# Altium schematic sheet DDR_HDMI.SchDoc
size A4; SheetNumber: 2; SheetTotal: 5
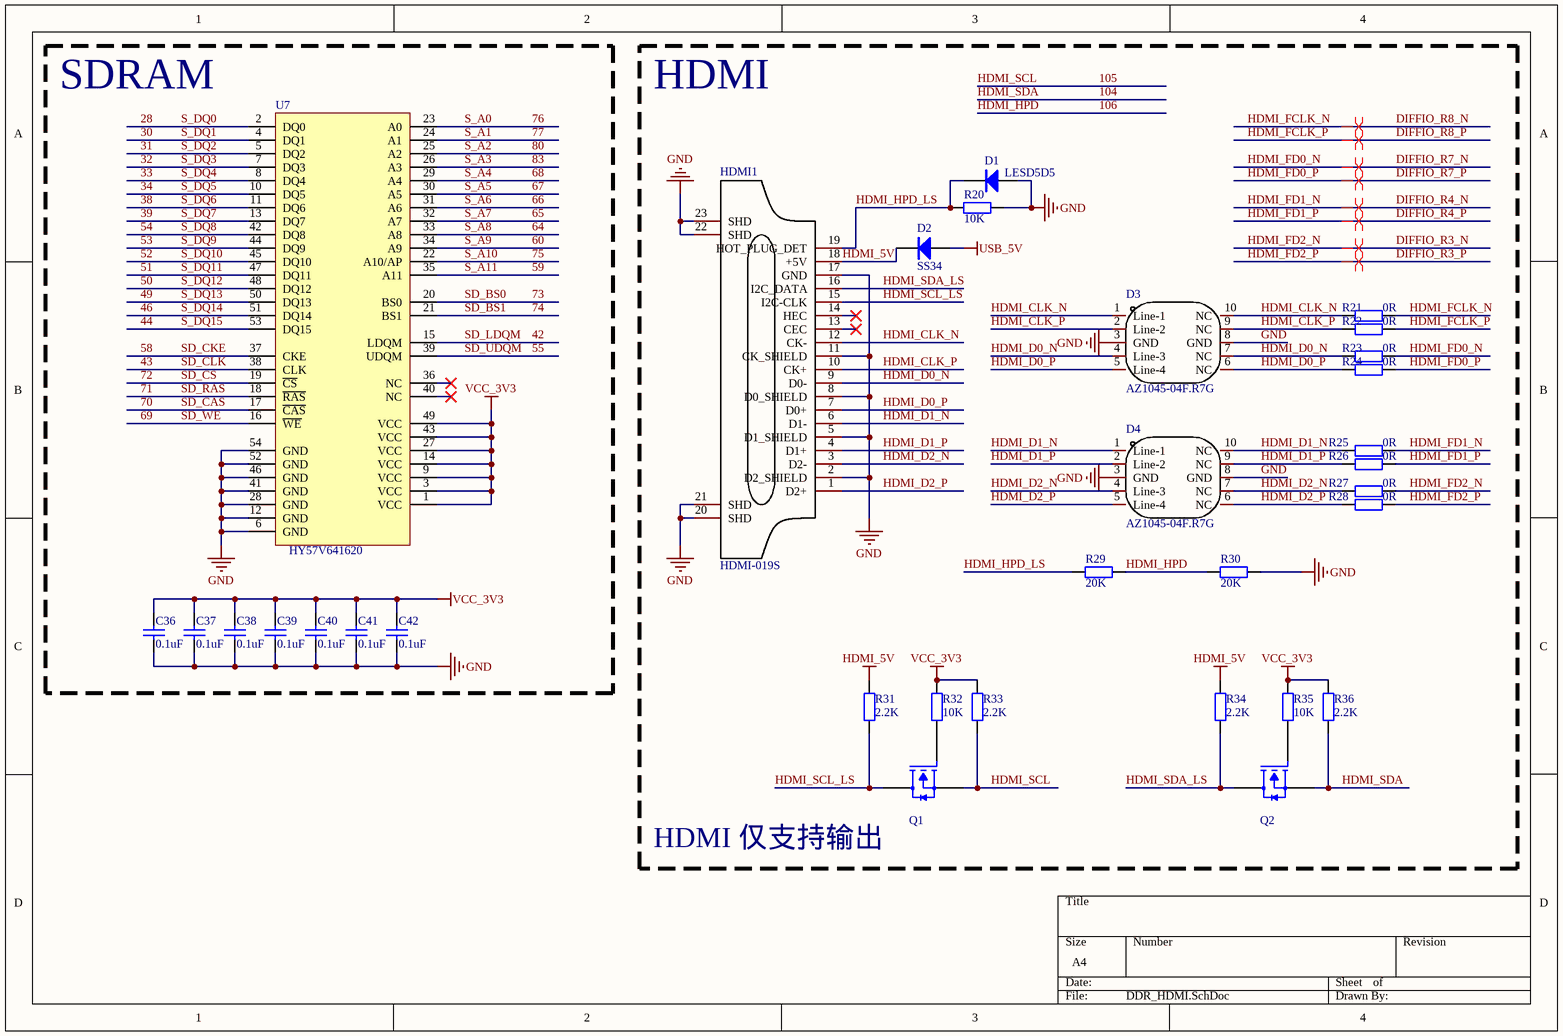
[diagram p0: DDR_HDMI.SchDoc]

## Parts
C36  0.1uF  [0402_C]
C37  0.1uF  [0402_C]
C38  0.1uF  [0402_C]
C39  0.1uF  [0402_C]
C40  0.1uF  [0402_C]
C41  0.1uF  [0402_C]
C42  0.1uF  [0402_C]
D1  LESD5D5  [SOD-523_L1.2-W0.8-LS1.6-RD]
D2  SS34  [SMC]
D3  AZ1045-04F.R7G  [DFN2510-10_L2.5-W1.0-P0.50-BL]
D4  AZ1045-04F.R7G  [DFN2510-10_L2.5-W1.0-P0.50-BL]
HDMI1  HDMI-019S  [HDMI-SMD_HDMI-019S]
Q1  AO3400A  [SOT23-3]  (value not drawn)
Q2  AO3400A  [SOT23-3]  (value not drawn)
R20  10K  [0402_R]
R21  0R  [0402_R]
R22  0R  [0402_R]
R23  0R  [0402_R]
R24  0R  [0402_R]
R25  0R  [0402_R]
R26  0R  [0402_R]
R27  0R  [0402_R]
R28  0R  [0402_R]
R29  20K  [0402_R]
R30  20K  [0402_R]
R31  2.2K  [0402_R]
R32  10K  [0402_R]
R33  2.2K  [0402_R]
R34  2.2K  [0402_R]
R35  10K  [0402_R]
R36  2.2K  [0402_R]
U7  HY57V641620  [TSOP-54_L22.2-W10.2-P0.80-LS11.8-BL]  (value not drawn)

## Blocks framed on the sheet
SDRAM: C36-C42 U7
HDMI: D1-D4 HDMI1 Q1 Q2 R20-R36

## Nets
GND: C36.1 C37.1 C38.1 C39.1 C40.1 C41.1 C42.1 D1.1(A) D3.3(GND) D3.8(GND) D4.3(GND) D4.8(GND) HDMI1.2(D2_SHIELD) HDMI1.5(D1_SHIELD) HDMI1.8(D0_SHIELD) HDMI1.11(CK_SHIELD) HDMI1.17(GND) HDMI1.20(SHD) HDMI1.21(SHD) HDMI1.22(SHD) HDMI1.23(SHD) R20.2 R30.2 U7.6(GND) U7.12(GND) U7.28(GND) U7.41(GND) U7.46(GND) U7.52(GND) U7.54(GND)
HDMI_5V: D2.2(K) HDMI1.18(+5V) R31.2 R34.2
USB_5V: D2.1(A)
VCC_3V3: C36.2 C37.2 C38.2 C39.2 C40.2 C41.2 C42.2 R32.2 R33.2 R35.2 R36.2 U7.1(VCC) U7.3(VCC) U7.9(VCC) U7.14(VCC) U7.27(VCC) U7.43(VCC) U7.49(VCC)
28: U7.2(DQ0)  [also labelled S_DQ0]
30: U7.4(DQ1)  [also labelled S_DQ1]
31: U7.5(DQ2)  [also labelled S_DQ2]
32: U7.7(DQ3)  [also labelled S_DQ3]
33: U7.8(DQ4)  [also labelled S_DQ4]
34: U7.10(DQ5)  [also labelled S_DQ5]
38: U7.11(DQ6)  [also labelled S_DQ6]
39: U7.13(DQ7)  [also labelled S_DQ7]
42: U7.15(LDQM)  [also labelled SD_LDQM]
43: U7.38(CLK)  [also labelled SD_CLK]
44: U7.53(DQ15)  [also labelled S_DQ15]
46: U7.51(DQ14)  [also labelled S_DQ14]
49: U7.50(DQ13)  [also labelled S_DQ13]
50: U7.48(DQ12)  [also labelled S_DQ12]
51: U7.47(DQ11)  [also labelled S_DQ11]
52: U7.45(DQ10)  [also labelled S_DQ10]
53: U7.44(DQ9)  [also labelled S_DQ9]
54: U7.42(DQ8)  [also labelled S_DQ8]
55: U7.39(UDQM)  [also labelled SD_UDQM]
58: U7.37(CKE)  [also labelled SD_CKE]
59: U7.35(A11)  [also labelled S_A11]
60: U7.34(A9)  [also labelled S_A9]
64: U7.33(A8)  [also labelled S_A8]
65: U7.32(A7)  [also labelled S_A7]
66: U7.31(A6)  [also labelled S_A6]
67: U7.30(A5)  [also labelled S_A5]
68: U7.29(A4)  [also labelled S_A4]
69: U7.16(~{WE})  [also labelled SD_WE]
70: U7.17(~{CAS})  [also labelled SD_CAS]
71: U7.18(~{RAS})  [also labelled SD_RAS]
72: U7.19(~{CS})  [also labelled SD_CS]
73: U7.20(BS0)  [also labelled SD_BS0]
74: U7.21(BS1)  [also labelled SD_BS1]
75: U7.22(A10/AP)  [also labelled S_A10]
76: U7.23(A0)  [also labelled S_A0]
77: U7.24(A1)  [also labelled S_A1]
80: U7.25(A2)  [also labelled S_A2]
83: U7.26(A3)  [also labelled S_A3]
104: Q2.2(S) R36.1  [also labelled HDMI_SDA]
105: Q1.2(S) R33.1  [also labelled HDMI_SCL]
106: R29.2 R30.1  [also labelled HDMI_HPD]
DIFFIO_R3_N: R27.2  [also labelled HDMI_FD2_N]
DIFFIO_R3_P: R28.2  [also labelled HDMI_FD2_P]
DIFFIO_R4_N: R25.2  [also labelled HDMI_FD1_N]
DIFFIO_R4_P: R26.2  [also labelled HDMI_FD1_P]
DIFFIO_R7_N: R23.2  [also labelled HDMI_FD0_N]
DIFFIO_R7_P: R24.2  [also labelled HDMI_FD0_P]
DIFFIO_R8_N: R21.2  [also labelled HDMI_FCLK_N]
DIFFIO_R8_P: R22.2  [also labelled HDMI_FCLK_P]
HDMI_CLK_N: D3.1(Line-1) D3.10(NC) HDMI1.12(CK-) R21.1
HDMI_CLK_P: D3.2(Line-2) D3.9(NC) HDMI1.10(CK+) R22.1
HDMI_D0_N: D3.4(Line-3) D3.7(NC) HDMI1.9(D0-) R23.1
HDMI_D0_P: D3.5(Line-4) D3.6(NC) HDMI1.7(D0+) R24.1
HDMI_D1_N: D4.1(Line-1) D4.10(NC) HDMI1.6(D1-) R25.1
HDMI_D1_P: D4.2(Line-2) D4.9(NC) HDMI1.4(D1+) R26.1
HDMI_D2_N: D4.4(Line-3) D4.7(NC) HDMI1.3(D2-) R27.1
HDMI_D2_P: D4.5(Line-4) D4.6(NC) HDMI1.1(D2+) R28.1
HDMI_HPD_LS: D1.2(K) HDMI1.19(HOT_PLUG_DET) R20.1 R29.1
HDMI_SCL_LS: HDMI1.15(I2C-CLK) Q1.3(D) R31.1
HDMI_SDA_LS: HDMI1.16(I2C_DATA) Q2.3(D) R34.1
NetQ1_1: Q1.1(G) R32.1
NetQ2_1: Q2.1(G) R35.1

Not connected (* = marked no-connect by the designer): HDMI1 13(CEC)* 14(HEC)*; U7 36(NC)* 40(NC)*

## Layout directives
differential pair: DIFFIO_R3_N, DIFFIO_R3_P, DIFFIO_R4_N, DIFFIO_R4_P, DIFFIO_R7_N, DIFFIO_R7_P, DIFFIO_R8_N, DIFFIO_R8_P

## Notes on the sheet
- HDMI 仅支持输出

## Library data of the parts
C36-C42 = 0402_C: 贴片电容; ComponentLink1Description: 供应商链接; ComponentLink1URL: http://www.szlcsc.com/product/details_1928.html; Package: 0402; Supplier: LC; SuppliersPartNumber: C1576
D1 = 1N5819: 肖特基二极管; 版权归属: 源创客; 属性: 40V/2A; BOM名称: 肖特基二极管; 学习资源: www.ooocke.com
D2 = SS34: 肖特基二极管; 版权归属: 源创客; 属性: 40V/3A; BOM名称: 肖特基二极管; 学习资源: www.ooocke.com
D3 D4 = AZ1045-04F.R7G: 反向截止电压(Vrwm):5V;击穿电压:6V;最大钳位电压:12V;; Manufacturer: AMAZING(晶焱); Add into BOM: yes; Reverse Stand-Off Voltage (Vrwm): 5V; Breakdown Voltage: 6V; Peak Pulse Current (Ipp)@10/1000μs: 3.5A@8/20us; Maximum Clamping Voltage: 12V; Symbol: AZ1045-04F.R7G; Device: AZ1045-04F.R7G; LCSC Part Name: AZ1045-04F.R7G; Supplier Part: C356811; Manufacturer Part: AZ1045-04F.R7G; Supplier Footprint: DFN-10(1x2.5); JLCPCB Part Class: Extended Part; Datasheet: https://atta.szlcsc.com/upload/public/pdf/source/20190802/C356811_0B9EAE80F3B7F983A0CAF91AEAB45A28.pdf; Supplier: LCSC; Convert to PCB: yes; Name: AZ1045-04F.R7G
HDMI1 = HDMI-019S: 连接器类型:HDMI;公母:母;总PIN位数:19;排数:-;安装方式:卧贴;额定电流:500mA;工作温度范围:-25℃~+75℃;; Manufacturer: SOFNG(硕方); Add into BOM: yes; Connector Type: HDMI; Gender: 母; Current Rating (Max): 500mA; Symbol: HDMI-019S; Device: HDMI-019S; LCSC Part Name: HDMI 母 P数:19; Supplier Part: C111617; Manufacturer Part: HDMI-019S; Supplier Footprint: SMD; JLCPCB Part Class: Extended Part; Datasheet: https://atta.szlcsc.com/upload/public/pdf/source/20200911/C111617_84DD1BD35B9EB8A28224A63520745D0A.pdf; Supplier: LCSC; Convert to PCB: yes; Number of Pins: 19; Number of Rows: -; Mounting Style: 卧贴; Operating Temperature Range: -25℃~+75℃; Name: HDMI-019S
Q1 Q2 = AO3400A: N-MOS
R20-R36 = 0402_R: 贴片电阻; ComponentLink1Description: 供应商链接; ComponentLink1URL: http://www.szlcsc.com/product/details_26667.html; Package: 0402; Supplier: LC; SuppliersPartNumber: C25924